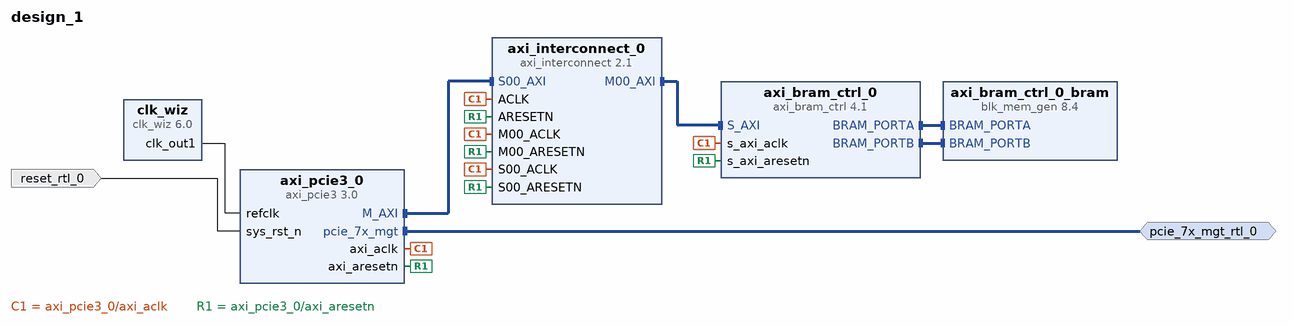
[diagram p0: block diagram of the top level]
# Vivado block design design_1, xcvu13p-fsga2577-3-e, Vivado 2019.1
create_bd_design design_1

create_bd_intf_port -mode Master -vlnv xilinx.com:interface:pcie_7x_mgt_rtl:1.0 pcie_7x_mgt_rtl_0
create_bd_port -dir I -type rst reset_rtl_0
set_property -dict {CONFIG.POLARITY ACTIVE_LOW} [get_bd_ports reset_rtl_0]

create_bd_cell -type ip -vlnv xilinx.com:ip:axi_pcie3:3.0 axi_pcie3_0
create_bd_cell -type ip -vlnv xilinx.com:ip:axi_bram_ctrl:4.1 axi_bram_ctrl_0
set_property -dict {CONFIG.DATA_WIDTH 64} [get_bd_cells axi_bram_ctrl_0]
create_bd_cell -type ip -vlnv xilinx.com:ip:axi_interconnect:2.1 axi_interconnect_0
create_bd_cell -type ip -vlnv xilinx.com:ip:clk_wiz:6.0 clk_wiz
create_bd_cell -type ip -vlnv xilinx.com:ip:blk_mem_gen:8.4 axi_bram_ctrl_0_bram
set_property -dict {CONFIG.Memory_Type True_Dual_Port_RAM} [get_bd_cells axi_bram_ctrl_0_bram]

# ---- connections ----

connect_bd_intf_net [get_bd_intf_pins axi_bram_ctrl_0_bram/BRAM_PORTA] [get_bd_intf_pins axi_bram_ctrl_0/BRAM_PORTA]
connect_bd_intf_net [get_bd_intf_pins axi_bram_ctrl_0_bram/BRAM_PORTB] [get_bd_intf_pins axi_bram_ctrl_0/BRAM_PORTB]
connect_bd_intf_net [get_bd_intf_ports pcie_7x_mgt_rtl_0] [get_bd_intf_pins axi_pcie3_0/pcie_7x_mgt]
connect_bd_intf_net [get_bd_intf_pins axi_interconnect_0/M00_AXI] [get_bd_intf_pins axi_bram_ctrl_0/S_AXI]
connect_bd_intf_net [get_bd_intf_pins axi_pcie3_0/M_AXI] [get_bd_intf_pins axi_interconnect_0/S00_AXI]
connect_bd_net -net reset_rtl_0_1 [get_bd_ports reset_rtl_0] [get_bd_pins axi_pcie3_0/sys_rst_n]
connect_bd_net [get_bd_pins clk_wiz/clk_out1] [get_bd_pins axi_pcie3_0/refclk]
connect_bd_net [get_bd_pins axi_pcie3_0/axi_aclk] \
  [get_bd_pins axi_interconnect_0/S00_ACLK] [get_bd_pins axi_bram_ctrl_0/s_axi_aclk] \
  [get_bd_pins axi_interconnect_0/M00_ACLK] [get_bd_pins axi_interconnect_0/ACLK]
connect_bd_net [get_bd_pins axi_pcie3_0/axi_aresetn] \
  [get_bd_pins axi_interconnect_0/S00_ARESETN] [get_bd_pins axi_bram_ctrl_0/s_axi_aresetn] \
  [get_bd_pins axi_interconnect_0/M00_ARESETN] [get_bd_pins axi_interconnect_0/ARESETN]

# ---- address map ----
assign_bd_address -offset 0xC0000000 -range 8K -target_address_space [get_bd_addr_spaces axi_pcie3_0/M_AXI] [get_bd_addr_segs axi_bram_ctrl_0/S_AXI/Mem0]

validate_bd_design
save_bd_design
